# EAGLE design gps-carrier (EAGLE 5.11)
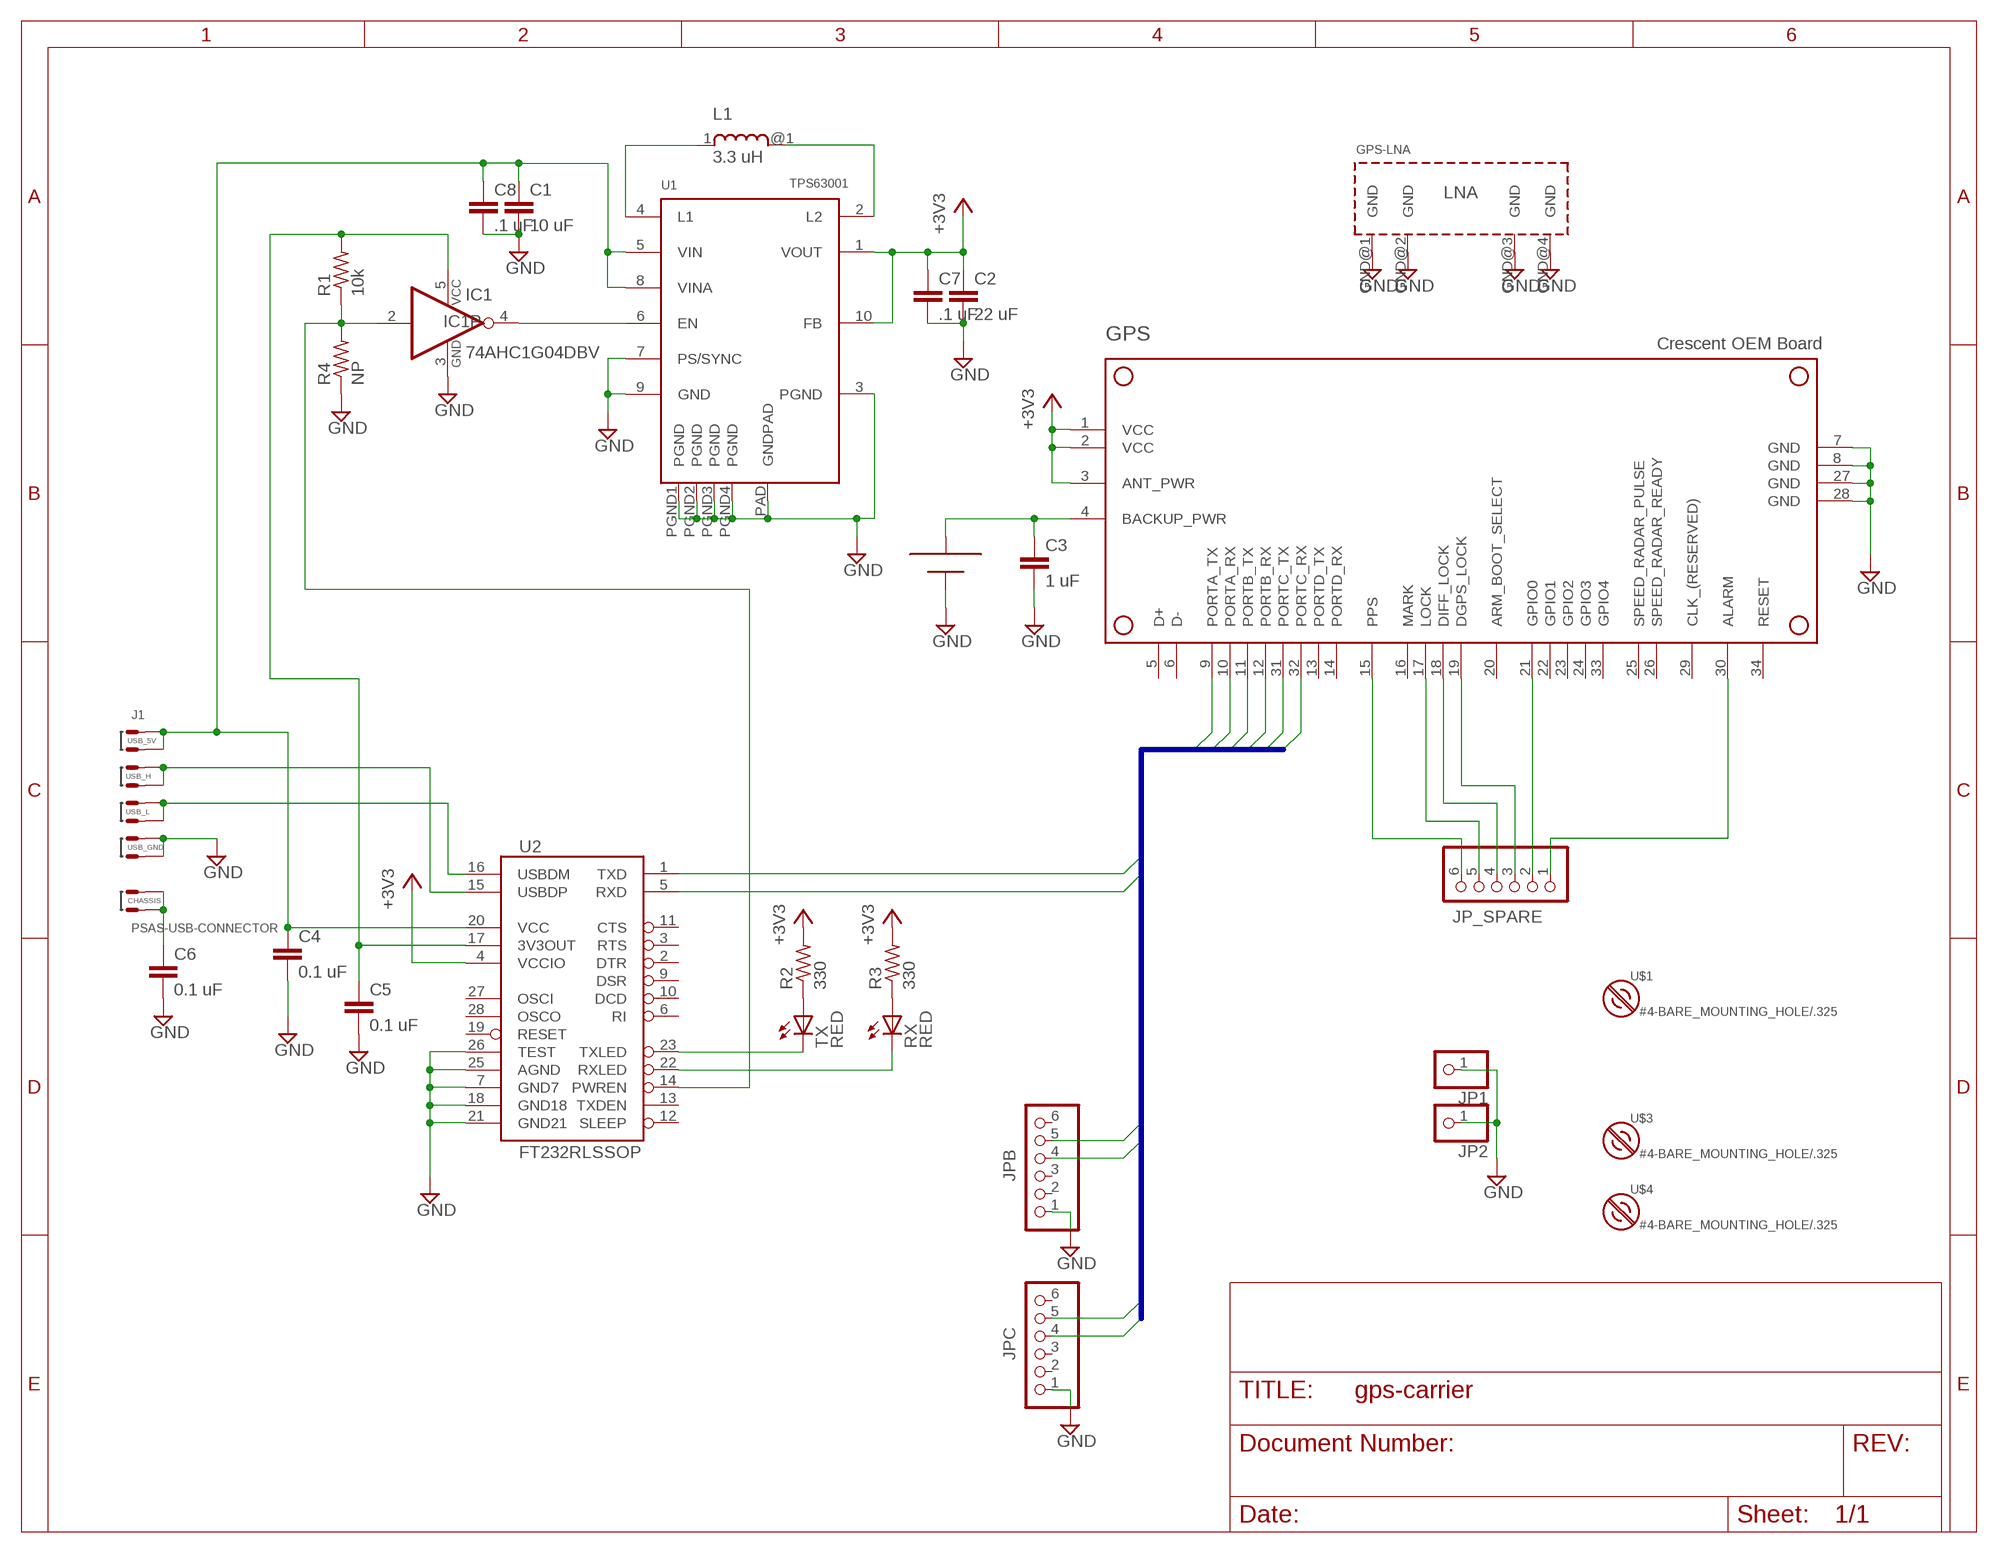
[diagram p0: schematic, sheet 1]

## Parts
BAT1  COINBAT  [COINBAT]
C1  10 uF  C-EU0805-B-NOSILK  [0805-B-NOSILK]
C2  22 uF  C-EU0805-B-NOSILK  [0805-B-NOSILK]
C3  1 uF  C-EU0603-B-NOSILK  [0603-B-NOSILK]
C4  0.1 uF  C-EU0603-B-NOSILK  [0603-B-NOSILK]
C5  0.1 uF  C-EU0603-B-NOSILK  [0603-B-NOSILK]
C6  0.1 uF  C-EU0603-B-NOSILK  [0603-B-NOSILK]
C7  .1 uF  C-EU0603-B-NOSILK  [0603-B-NOSILK]
C8  .1 uF  C-EU0603-B-NOSILK  [0603-B-NOSILK]
GPS  HEMISPHERE_GPS_MOUNT  [GPS_CRECENT_OUTLINE]
GPS-LNA  GPS_LNA  [GPS_LNA]
IC1  74AHC1G04DBV  [SOT23-5]
J1  PSAS-USB-CONNECTOR  [USB-CONNECTOR-PKG]
JP1  PINHD-1X1  [1X01]
JP2  PINHD-1X1  [1X01]
JP_SPARE  PINHD-1X6  [1X06]
JPB  PINHD-1X6  [1X06]
JPC  PINHD-1X6  [1X06]
L1  3.3 uH  CB2518  [SMD1007]
R1  10k  R-US_0603-B-NOSILK  [0603-B-NOSILK]
R2  330  R-US_0603-B-NOSILK  [0603-B-NOSILK]
R3  330  R-US_0603-B-NOSILK  [0603-B-NOSILK]
R4  NP  R-US_0603-B-NOSILK  [0603-B-NOSILK]
RX  RED  LEDCHIP-LED0603  [CHIP-LED0603]
TX  RED  LEDCHIP-LED0603  [CHIP-LED0603]
U1  TPS63001  [TPS63001]
U2  FT232RLSSOP  [SSOP28DB]
U$1  #4-BARE_MOUNTING_HOLE/.325  [#4/.325-BARE+SMALL_TOOL_CLEARANCE]
U$3  #4-BARE_MOUNTING_HOLE/.325  [#4/.325-BARE+SMALL_TOOL_CLEARANCE]
U$4  #4-BARE_MOUNTING_HOLE/.325  [#4/.325-BARE+SMALL_TOOL_CLEARANCE]

## Nets
3V3FTDI: C5.1 IC1.5(VCC) R1.2 U2.17(3V3OUT)
+3V3: C2.1 C7.1 GPS.1(VCC) GPS.2(VCC) GPS.3(ANT_PWR) R2.2 R3.2 U1.1(VOUT) U1.10(FB) U2.4(VCCIO)
ALARM: GPS.30(ALARM) JP_SPARE.1
D+: J1.USB_H@3(USB_H) J1.USB_H@4(USB_H) U2.15(USBDP)
D-: J1.USB_L@5(USB_L) J1.USB_L@6(USB_L) U2.16(USBDM)
DGPS_LOCK: GPS.19(DGPS_LOCK) JP_SPARE.3
DIFF_LOCK: GPS.18(DIFF_LOCK) JP_SPARE.4
EN: IC1.4(O) U1.6(EN)
GND: BAT1.- C1.2 C2.2 C3.2 C4.2 C5.2 C6.2 C7.2 C8.2 GPS-LNA.GND@1(GND) GPS-LNA.GND@2(GND) GPS-LNA.GND@3(GND) GPS-LNA.GND@4(GND) GPS.7(GND) GPS.8(GND) GPS.27(GND) GPS.28(GND) IC1.3(GND) J1.B-@7(GND) J1.B-@8(GND) JP1.1 JP2.1 JPB.1 JPC.1 R4.1 U1.3(PGND) U1.7(PS/SYNC) U1.9(GND) U1.PAD(GNDPAD) U1.PGND1(PGND) U1.PGND2(PGND) U1.PGND3(PGND) U1.PGND4(PGND) U2.7(GND7) U2.18(GND18) U2.21(GND21) U2.25(AGND) U2.26(TEST)
GPIO0: GPS.21(GPIO0) JP_SPARE.2
LEDRX: RX.C U2.22(RXLED)
LEDTX: TX.C U2.23(TXLED)
LOCK: GPS.17(LOCK) JP_SPARE.5
N$1: L1.1 U1.4(L1)
N$2: L1.@1 U1.2(L2)
N$3: BAT1.+ C3.1 GPS.4(BACKUP_PWR)
N$7: R2.1 TX.A
N$8: C6.1 J1.CHASSIS@1(CHASSIS) J1.CHASSIS@2(CHASSIS)
N$10: R3.1 RX.A
PORT_A_RX: GPS.10(PORTA_RX) U2.5(RXD)
PORT_A_TX: GPS.9(PORTA_TX) U2.1(TXD)
PORT_B_RX: GPS.12(PORTB_RX) JPB.5
PORT_B_TX: GPS.11(PORTB_TX) JPB.4
PORT_C_RX: GPS.32(PORTC_RX) JPC.5
PORT_C_TX: GPS.31(PORTC_TX) JPC.4
PPS: GPS.15(PPS) JP_SPARE.6
PWNEN: IC1.2(I) R1.1 R4.2 U2.14(PWREN)
VUSB: C1.1 C4.1 C8.1 J1.B+@1(5V) J1.B+@2(5V) U1.5(VIN) U1.8(VINA) U2.20(VCC)
Unconnected: GPS.5(D+) GPS.6(D-) GPS.13(PORTD_TX) GPS.14(PORTD_RX) GPS.16(MARK) GPS.20(ARM_BOOT_SELECT) GPS.22(GPIO1) GPS.23(GPIO2) GPS.24(GPIO3) GPS.25(SPEED_RADAR_PULSE) GPS.26(SPEED_RADAR_READY) GPS.29(CLK_(RESERVED)) GPS.33(GPIO4) GPS.34(RESET) JPB.2 JPB.3 JPB.6 JPC.2 JPC.3 JPC.6 U2.2(DTR) U2.3(RTS) U2.6(RI) U2.9(DSR) U2.10(DCD) U2.11(CTS) U2.12(SLEEP) U2.13(TXDEN) U2.19(RESET) U2.27(OSCI) U2.28(OSCO)

## Buses
PORT_A_TX,PORT_A_RX,PORT_B_TX,PORT_B_RX,PORT_C_TX,PORT_C_RX

## Library data of the parts
BAT1 = GPS_Hemisphere:COINBAT
C1-C8 = rcl_custom:C-EU: CAPACITOR, European symbol
GPS = GPS_Hemisphere:HEMISPHERE_GPS_MOUNT: Outline for the "Hemisphere GPS" Crescent OEM Board
GPS-LNA = GPS_Hemisphere:GPS_LNA
IC1 = 74xx-little-us:74*1G04: INVERTER Gate
J1 = usb-connector:PSAS-USB-CONNECTOR
JP1 JP2 = pinhead:PINHD-1X1: PIN HEADER
JP_SPARE JPB JPC = pinhead:PINHD-1X6: PIN HEADER
L1 = GPS_Hemisphere:CB2518: 3.3 uH Inductor
R1-R4 = rcl_custom:R-US_: RESISTOR, American symbol
RX TX = led:LED: LED OSRAM: - CHIPLED LG R971, LG N971, LY N971, LG Q971, LY Q971, LO R971, LY R971 LH N974, LH R974 LS Q976, LO Q976, LY Q976 LO Q996 - Hyper CHIPLED LW Q18S LB Q993, LB Q99A, LB R99A - SideLED LS A670, LO A670, LY A670, LG A670, LP A670 LB A673, LV A673, LT A673, LW A673 LH A674 LY A675 LS A676, LA A676, LO A676, LY A676, LW A676 LS A679, LY A679, LG A679 - Hyper Micro SIDELED® LS Y876, LA Y876, LO Y876, LY Y876 LT Y87S - SmartLED LW L88C, LW L88S LB L89C, LB L89S, LG L890 LS L89K, LO L89K, LY L89K LS L896, LA L896, LO L896, LY L896 - TOPLED LS T670, LO T670, LY T670, LG T670, LP T670 LSG T670, LSP T670, LSY T670, LOP T670, LYG T670 LG T671, LOG T671, LSG T671 LB T673, LV T673, LT T673, LW T673 LH T674 LS T676, LA T676, LO T676, LY T676, LB T676, LH T676, LSB T676, LW T676 LB T67C, LV T67C, LT T67C, LS T67K, LO T67K, LY T67K, LW E67C LS E67B, LA E67B, LO E67B, LY E67B, LB E67C, LV E67C, LT E67C LW T67C LS T679, LY T679, LG T679 LS T770, LO T770, LY T770, LG T770, LP T770 LB T773, LV T773, LT T773, LW T773 LH T774 LS E675, LA E675, LY E675, LS T675 LS T776, LA T776, LO T776, LY T776, LB T776 LHGB T686 LT T68C, LB T68C - Hyper Mini TOPLED® LB M676 - Mini TOPLED Santana® LG M470 LS M47K, LO M47K, LY M47K Source: http://www.osram.convergy.de LUXEON: - LUMILED® LXK2-PW12-R00, LXK2-PW12-S00, LXK2-PW14-U00, LXK2-PW14-V00 LXK2-PM12-R00, LXK2-PM12-S00, LXK2-PM14-U00 LXK2-PE12-Q00, LXK2-PE12-R00, LXK2-PE12-S00, LXK2-PE14-T00, LXK2-PE14-U00 LXK2-PB12-K00, LXK2-PB12-L00, LXK2-PB12-M00, LXK2-PB14-N00, LXK2-PB14-P00, LXK2-PB14-Q00 LXK2-PR12-L00, LXK2-PR12-M00, LXK2-PR14-Q00, LXK2-PR14-R00 LXK2-PD12-Q00, LXK2-PD12-R00, LXK2-PD12-S00 LXK2-PH12-R00, LXK2-PH12-S00 LXK2-PL12-P00, LXK2-PL12-Q00, LXK2-PL12-R00 Source: www.luxeon.com KINGBRIGHT: KA-3528ASYC Source: www.kingbright.com
U1 = GPS_Hemisphere:TPS63001: High efficiency buck boost SPS
U2 = GPS_Hemisphere:FT232RL: USB UART FT232RL 4th Generation USB UART (USB <-> Serial) Controller. Spark Fun Electronics SKU : COM-00650
U$1 U$3 U$4 = mount:#4-BARE_MOUNTING_HOLE: 1/8" drill hole for #4 screw mount

## Board
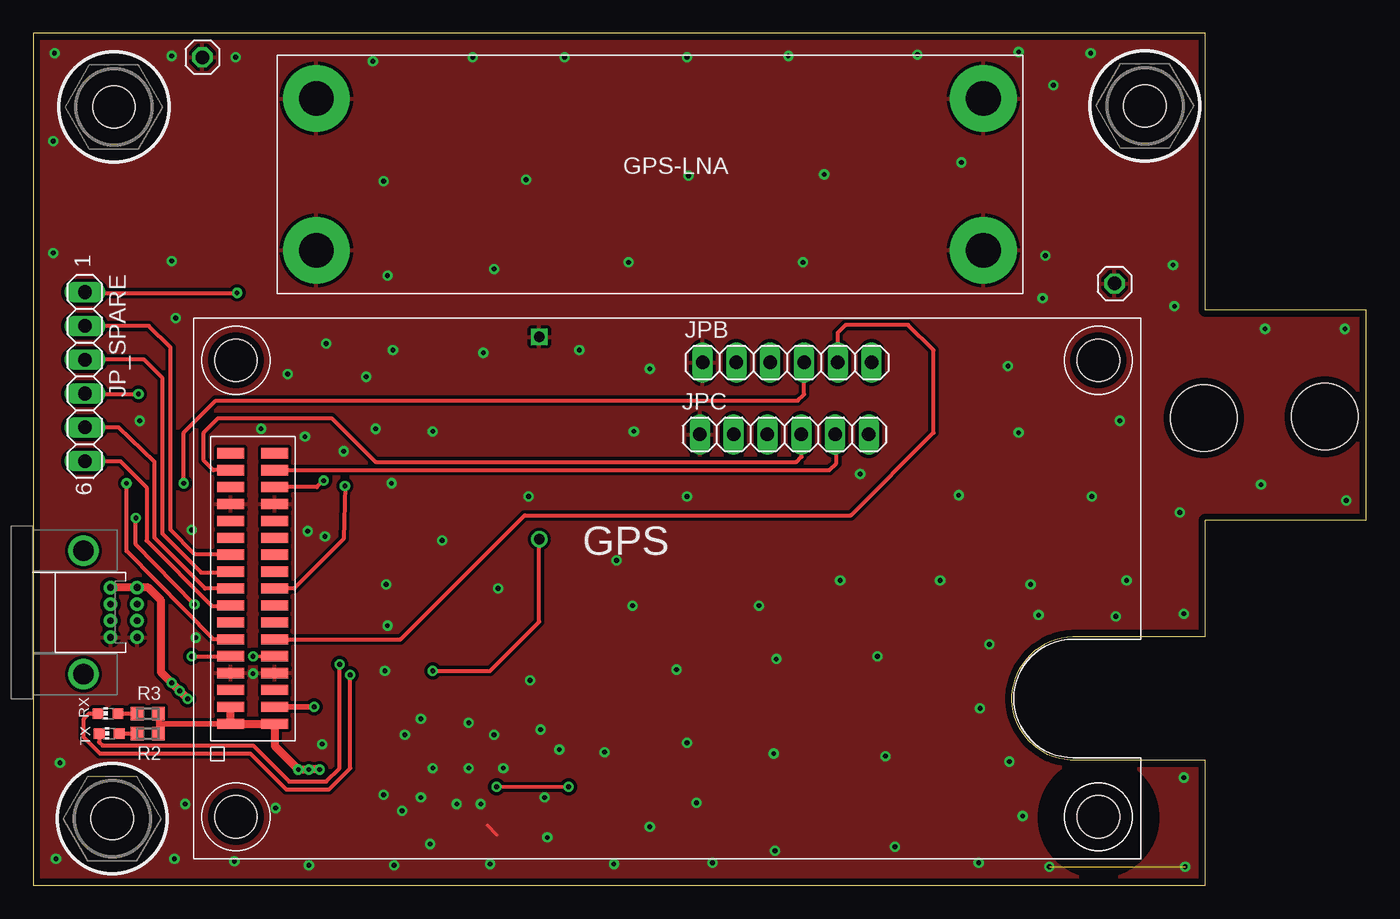
[diagram p1: board, top side]
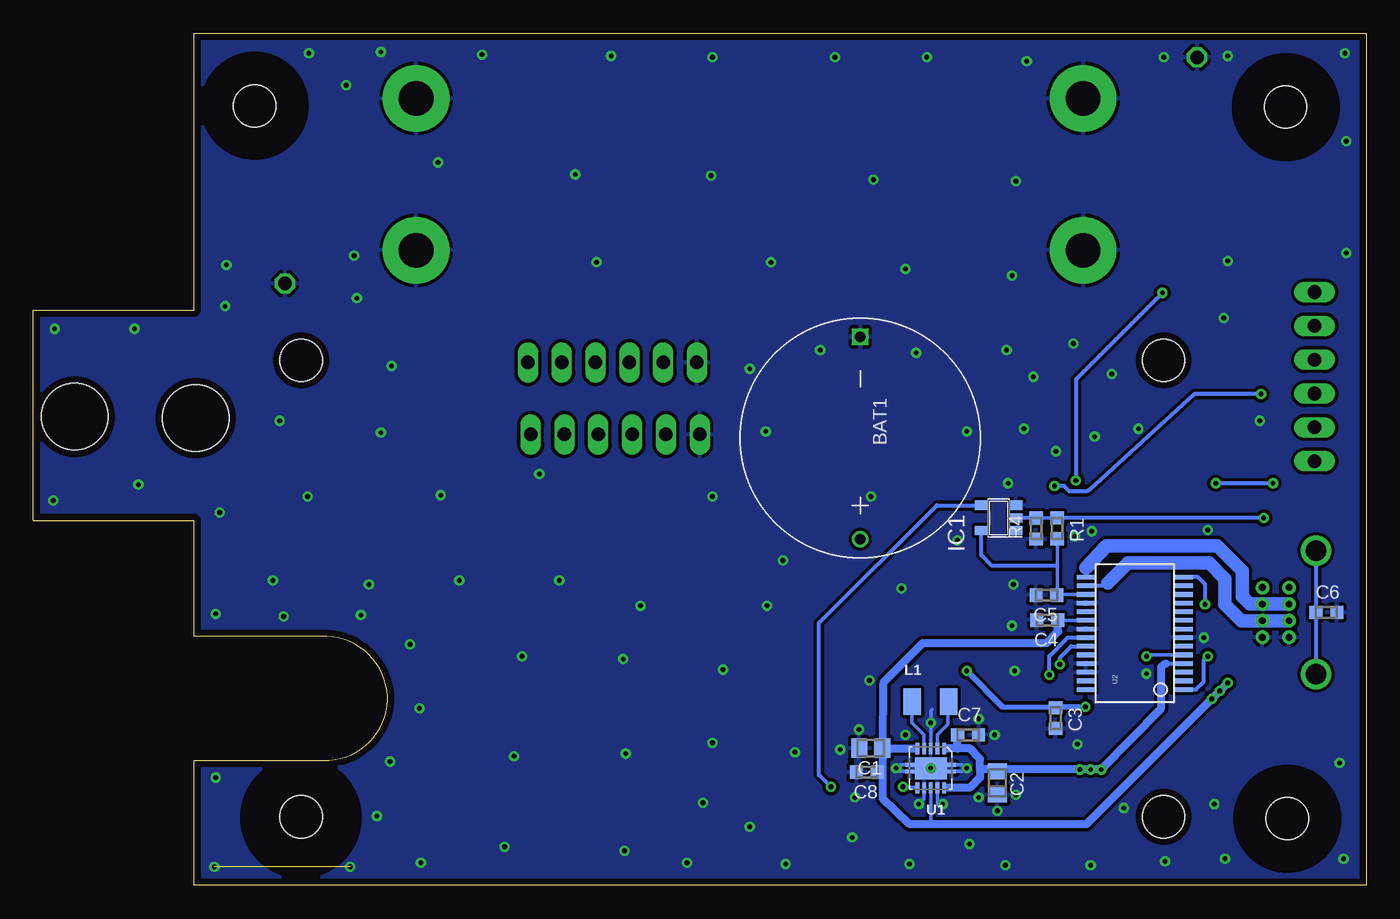
[diagram p2: board, bottom side, seen from below]

Size 100.1 x 64 mm. Coordinates in mm from the lower left corner, seen from the top.
Outline: 0,0 88,0 88,9.4 78.3,9.4 arc-90 73.5,13.9 73.5,14.2 arc-90 78.5,18.7 88,18.7 88,27.4 100.1,27.4 100.1,43.2 88,43.2 88,64 0,64 0,0
Copper layers (1*16): Top 0.0178mm / dielectric 1.4986mm / Bottom 0.0178mm
Design rules "sunstone_eagle_2lyr_rules_v1.0.0.3": minimum track width 6mil, minimum drill 14mil, track to track 6mil, track to pad 6mil, pad to pad 6mil, via to via 6mil, smd to smd 6mil, copper to edge 20mil, drill to drill 16mil, minimum pad ring 8mil, minimum via ring 8mil, stop-mask expansion 3mil, vias tented up to drill 0mil, thermal gap 10mil
Holes 5 mm at 87.9,35.1 97,35.2
tRestrict: area 75.9,1 to 84.1,9.2
bRestrict: area 75.9,1 to 84.1,9.2

### Footprints (pad centres in the part's own frame; a part is rotated, then mirrored left to right if it is on the bottom)
COINBAT = drill 0.8 round: + 7.6,0 | drill 0.8 square: - -7.6,0
0805-B-NOSILK = smd 1.15 x 1.45: 1 -0.9,0; 2 0.9,0
0603-B-NOSILK = smd 0.95 x 1: 1 -0.8,0; 2 0.8,0
GPS_CRECENT_OUTLINE = smd 2.032 x 0.762: 1 -32.766,-10.16; 2 -29.464,-10.16; 3 -32.766,-8.89; 4 -29.464,-8.89; 5 -32.766,-7.62; 6 -29.464,-7.62; 7 -32.766,-6.35; 8 -29.464,-6.35; 9 -32.766,-5.08; 10 -29.464,-5.08; 11 -32.766,-3.81; 12 -29.464,-3.81; 13 -32.766,-2.54; 14 -29.464,-2.54; 15 -32.766,-1.27; 16 -29.464,-1.27; 17 -32.766,0; 18 -29.464,0; 19 -32.766,1.27; 20 -29.464,1.27; 21 -32.766,2.54; 22 -29.464,2.54; 23 -32.766,3.81; 24 -29.464,3.81; 25 -32.766,5.08; 26 -29.464,5.08; 27 -32.766,6.35; 28 -29.464,6.35; 29 -32.766,7.62; 30 -29.464,7.62; 31 -32.766,8.89; 32 -29.464,8.89; 33 -32.766,10.16; 34 -29.464,10.16 | hole 3.175: -32.385,17.145; -32.385,-17.145; 32.385,-17.145; 32.385,17.145
GPS_LNA = drill 2.6 pad 5 round: GND@1 -25.05,5.7; GND@2 -25.05,-5.7; GND@3 25.05,5.7; GND@4 25.05,-5.7
SOT23-5 = smd 0.69 x 0.99: 1 -0.95,-1.29; 2 0,-1.29; 3 0.95,-1.29; 4 0.95,1.3; 5 -0.95,1.3
USB-CONNECTOR-PKG = drill 0.508 pad 1.016 round: B+@1 2,1.875; B+@2 0,1.875; B-@7 2,-1.875; B-@8 0,-1.875; USB_H@3 2,0.625; USB_H@4 0,0.625; USB_L@5 2,-0.625; USB_L@6 0,-0.625 | drill 1.511 round: CHASSIS@1 -2.032,4.636; CHASSIS@2 -2.032,-4.636
1X01 = drill 1.016 octagon: 1 0,0
1X06 = drill 1.016 long: 1 -6.35,0; 2 -3.81,0; 3 -1.27,0; 4 1.27,0; 5 3.81,0; 6 6.35,0
SMD1007 = smd 1.3 x 2: 1 -1.4,0; @1 1.35,0
CHIP-LED0603 = smd 0.8 x 0.8: A 0,-0.75; C 0,0.75
TPS63001 = smd 0.28 x 0.85: 1 -1,-1.475; 2 -0.5,-1.475; 3 0,-1.475; 4 0.5,-1.475; 5 1,-1.475; 6 1,1.475; 7 0.5,1.475; 8 0,1.475; 9 -0.5,1.475; 10 -1,1.475 | smd 2.4 x 1.65: PAD 0,0 | smd 0.7 x 0.28: PGND1 1.55,0.25; PGND2 -1.55,0.25; PGND3 -1.55,-0.25; PGND4 1.55,-0.25
SSOP28DB = smd 0.348 x 1.397: 1 -4.225,-3.656; 2 -3.575,-3.656; 3 -2.925,-3.656; 4 -2.275,-3.656; 5 -1.625,-3.656; 6 -0.975,-3.656; 7 -0.325,-3.656; 8 0.325,-3.656; 9 0.975,-3.656; 10 1.625,-3.656; 11 2.275,-3.656; 12 2.925,-3.656; 13 3.575,-3.656; 14 4.225,-3.656; 15 4.225,3.656; 16 3.575,3.656; 17 2.925,3.656; 18 2.275,3.656; 19 1.625,3.656; 20 0.975,3.656; 21 0.325,3.656; 22 -0.325,3.656; 23 -0.975,3.656; 24 -1.625,3.656; 25 -2.275,3.656; 26 -2.925,3.656; 27 -3.575,3.656; 28 -4.225,3.656
#4/.325-BARE+SMALL_TOOL_CLEARANCE = hole 3.175: 0,0

### Placement (x,y rotation side)
BAT1  38,33.6 270 bottom
C1  37.2,10.3 180 bottom
C2  27.7,7.7 270 bottom
C3  23.33,12.56 270 bottom
C4  23.94,19.93 180 bottom
C5  24,21.8 180 bottom
C6  3,20.5 0 bottom
C7  29.9,11.3 0 bottom
C8  37.5,8.5 180 bottom
GPS  47.6,22.29 0 top
GPS-LNA  46.3,53.4 0 top
IC1  27.6,27.6 90 bottom
J1  5.8,20.5 0 top
JP1  12.7,62.2 0 top
JP2  81.2,45.2 0 top
JP_SPARE  3.87,38.21 270 top
JPB  56.61,39.27 0 top
JPC  56.4,33.87 0 top
L1  32.7,13.8 0 bottom
R1  23.2,26.8 270 bottom
R2  8.6,11.4 0 top
R3  8.6,12.9 0 top
R4  24.8,26.8 90 bottom
RX  5.6,12.9 90 top
TX  5.7,11.4 90 top
U1  32.7,8.8 180 bottom
U2  17.39,18.93 90 bottom
U$1  5.93,5.01 0 top
U$3  6.05,58.46 0 top
U$4  83.48,58.55 0 top

### Tracks (layer width: path | path; a pad name or v marks a point on that pad's centre or on a via)
3V3FTDI
  Bottom 0.25: 23.2,21.98 23.2,24 R1.2
  Bottom 0.254: U2.17 23.11,21.86 C5.1
  Bottom 0.3: IC1.5 28.9,24.8 28.1,24 23.2,24
  Bottom 0.305: IC1.5 29,26.63
  Bottom 0.406: IC1.5 29,26.73 | C5.1 23.08,21.86
  Bottom 0.61: 23.08,21.86 23.2,21.98
+3V3  (via drill 0.36)
  Top 0.406: R2.2 R3.2 9.4,12.13 GPS.1
  Top 0.6: GPS.3 GPS.1 GPS.2 18.14,10.46 v19.9,8.7 v20.7,8.7 v21.5,8.7
  Bottom 0.25: 29,8.7 27.69,8.7 C2.1 | 31.52,10.28 U1.1 | 31.52,7.33 U1.10
  Bottom 0.305: 15.04,16.66 U2.4
  Bottom 0.6: 29,8.7 29,8.1 29.77,7.33 31.52,7.33 | 29,8.7 29,9.5 29.77,10.28 30.7,10.28 | 29,8.7 v21.5,8.7 v19.9,8.7 15.4,13.3 15.4,16.4 15.04,16.66 | 30.7,10.28 31.52,10.28 | 30.7,10.28 C7.1
ALARM  (via drill 0.36)
  Top 0.305: GPS.30 21.29,29.91 v21.8,30.4 | v15.3,44.5 3.93,44.5 JP_SPARE.1
  Bottom 0.305: v21.8,30.4 21.8,38 v15.3,44.5
D+
  Bottom 0.305: 21.05,23.86 U2.15
  Bottom 1: 21.05,23.86 19.5,25.5 11.2,25.5 9.3,23.6 9.3,21.7 8.72,21.12 J1.USB_H@3 J1.USB_H@4
D-
  Bottom 0.305: 19.4,22.7 19.4,22.5 U2.16
  Bottom 1: 19.4,22.7 17.9,24.2 11.8,24.2 10.6,23 10.6,21.1 9.38,19.88 J1.USB_L@5 J1.USB_L@6
DGPS_LOCK
  Top 0.305: JP_SPARE.3 8.32,39.48 9.7,38.1 9.7,26.4 12.6,23.5 14.77,23.5 GPS.19
DIFF_LOCK  (via drill 0.36)
  Top 0.305: GPS.18 19.59,22.29 23.3,26 v23.4,30 | v7.9,36.9 3.91,36.9 JP_SPARE.4
  Bottom 0.305: v7.9,36.9 12.9,36.9 20.8,29.7 21,29.6 22.3,29.6 22.7,30 v23.4,30
EN  (via drill 0.36)
  Top 0.25: v34.8,7.4 v40.2,7.4
  Bottom 0.25: U1.6 33.84,7.34 34.74,7.34 v34.8,7.4
  Bottom 0.3: IC1.4 32.25,28.55 41.1,19.7 41.1,8.3 v40.2,7.4
  Bottom 0.305: 29.03,28.6 IC1.4 28.97,28.6
GND  (via drill 0.36)  (1 unrouted)
  Top 0.25: 34.1,4.5 34.8,3.8
  Bottom 0.25: 31.67,6.03 32.17,6.03 32.2,6.06 U1.9 | 30.33,8.57 v30,8.8 30.35,8.55 U1.PGND2 | U1.3 32.7,13.1 32.67,13.13 | U1.7 33.2,6.5 33.4,6.3 | 30.35,9.05 U1.PGND3 | U1.PGND4 35.05,9.05 | U1.PGND1 35.05,8.55
  Bottom 0.254: v30,8.8 30,8.56 | 37.7,10.14 C1.2 | 32.67,13.13 32.6,13.2
  other vias: 32.7,8.8 39.5,10.2 27.7,5.6 29.8,3.1 42.9,10 49.1,10.7 49.8,6.2 46.3,4.4 32.7,12.2 37.3,15.4 27.9,11.3 34.9,22.3 30.7,25.9 26.5,22.6 26.6,19.5 26.9,30.2 37.2,29.2 49.1,29.2 43.8,24.4 45,21 54.5,21 55.7,2.6 55.6,9.9 55.8,17 60.6,22.9 68.1,22.9 74.9,22.6 82.1,22.9 63.4,17.2 64,9.7 64.7,2.9 71,1.7 73.3,9.3 71.8,18.1 75.5,20.3 81.3,20.2 71.1,13.3 74.3,5.2 48.3,16.2 62.1,30.9 69.5,29.3 79.5,29.2 73.2,39 74,34 81.6,34.9 46.3,38.8 33.8,40 27,40.2 45.1,34.1 30,34.1 23.3,32.6 20.4,33.7 17.1,34.3 22,40.7 10.7,42.6 1.5,47.5 26.6,45.8 25.5,61.9 33,62.2 39.9,62.2 49.1,62.2 56.7,62.3 66.4,62.4 74,62.6 79.4,62.5 76.6,60.1 76,47.3 75.8,44.1 85.6,46.6 85.7,43.5 51,1.7 43.6,1.6 34.3,1.6 38.6,3.6 38.4,6.6 27.1,1.5 20.7,1.5 15.1,1.8 10.6,2 11.4,6.1 2,9.2 1.7,2 20.6,26.6 12.2,18.6 10.4,46.9 21.9,26.2 11.9,26.7 8,34.9 19.1,38.4 25,38.2 25.7,34.3 41,40.2 26.3,52.9 37,53 49.2,53.3 59.4,53.4 69.7,54.3 57.8,46.8 44.7,46.8 34.6,46.3 15.2,62.2 10.4,62.3 1.6,62.5 1.5,55.9 92.2,30.1 92.5,41.8 98.5,41.8 98.6,28.9 86.1,28 86.4,20.4 86.4,8.1 86.5,1.4 76.3,1.4 18.2,5.8 21.7,10.6 33.6,6.1 31.8,6.1 16.5,15.9 35.3,8.8 26.4,16.1 29.1,12.5 26.3,6.8 34.6,11.3 38.1,11.7 29.1,6.6
  pour Top (isolate 0.25): 0,0 0,64 88,64 88,43.2 100.1,43.2 100.1,27.4 88,27.4 88,0
  pour Bottom (isolate 0.25): 0,0 0,64 88,64 88,43.2 100.1,43.2 100.1,27.4 88,27.4 88,0
GPIO0
  Top 0.305: JP_SPARE.2 8.68,42.02 10.3,40.4 10.3,26.7 12.1,24.9 14.76,24.9 GPS.21
LEDRX  (via drill 0.36)
  Top 0.305: RX.C 4.2,12.9 3.8,12.5 3.8,11.1 5,9.9 16.3,9.9 19,7.2 22.2,7.2 23.8,8.8 v23.8,15.8
  Bottom 0.305: U2.22 22.39,18.61 23.8,17.2 v23.8,15.8
LEDTX  (via drill 0.36)
  Top 0.305: TX.C 4.95,10.75 5.2,10.5 16.5,10.5 19.2,7.8 22,7.8 23,8.8 v23,16.6
  Bottom 0.305: v23,16.6 23,17.1 22.14,17.95 U2.23
LOCK
  Top 0.305: JP_SPARE.5 6.4,34.4 9.1,31.8 9.1,26.1 12.9,22.3 GPS.17
N$1
  Bottom 0.25: U1.4 33.2,11.3 34.1,12.2 L1.1
N$2
  Bottom 0.25: U1.2 32.2,11.3 31.4,12.1 31.4,13.75 L1.@1
N$3  (via drill 0.36)
  Top 0.305: v30,16.1 34.3,16.1 38,19.8 BAT1.+
  Top 0.406: GPS.4 v21.1,13.4
  Bottom 0.406: v21.1,13.4 23.32,13.4 C3.1 27.31,13.41 v30,16.1
N$7
  Top 0.305: TX.A R2.1
N$8
  Bottom 0.305: J1.CHASSIS@2 3.77,20.42 C6.1 3.77,20.58 J1.CHASSIS@1
N$10
  Top 0.305: RX.A R3.1
PORT_A_RX  (via drill 0.36)
  Top 0.254: v16.5,17.2 18.25,17.2 GPS.10
  Bottom 0.254: U2.5 16.3,17.3 v16.5,17.2
PORT_A_TX  (via drill 0.36)
  Top 0.305: v11.9,17.2 GPS.9
  Bottom 0.305: U2.1 12.79,14.71 12.2,15.3 12.2,16.9 v11.9,17.2
PORT_B_RX
  Top 0.305: JPB.5 60.4,39.29 60.4,41.5 61,42.1 65.7,42.1 67.6,40.2 67.6,34 61.4,27.8 36.9,27.8 27.58,18.48 GPS.12
PORT_B_TX  (via drill 0.36)
  Top 0.305: JPB.4 57.88,36.88 57.4,36.4 13.7,36.4 11.3,34 v11.3,30.2 | v7,30.2 7,25.1 13.5,18.5 14.81,18.5 GPS.11
  Bottom 0.305: v7,30.2 v11.3,30.2
PORT_C_RX
  Top 0.305: GPS.32 59.78,31.18 60.3,31.7 60.3,33.78 JPC.5
PORT_C_TX
  Top 0.305: JPC.4 57.7,33.84 57.7,32.2 57.3,31.8 25.7,31.8 22.4,35.1 13.9,35.1 12.8,34 12.8,31.9 13.52,31.18 GPS.31
PPS
  Top 0.305: JP_SPARE.6 6.54,31.86 8.5,29.9 8.5,25.9 13.4,21 14.81,21 GPS.15
PWNEN  (via drill 0.36)
  Top 0.305: v12.1,21.1 7.7,25.6 v7.7,27.6
  Bottom 0.25: R1.1 23.3,27.5 23.4,27.6 25.1,27.6
  Bottom 0.254: 13.8,23.16 U2.14
  Bottom 0.3: 25.1,27.6 IC1.2
  Bottom 0.305: v7.7,27.6 R1.1 | 25.1,27.6 R4.2 | 13.8,23.16 12.65,23.16 12.1,22.6 v12.1,21.1
VUSB  (via drill 0.36)
  Top 0.6: J1.B+@2 J1.B+@1 8.62,22.38 9.6,21.4 9.6,16 v10.4,15.2 v11,14.6 v11.6,14
  Bottom 0.25: 33.88,10.28 U1.5 | U1.8 32.7,4.86 32.67,4.83 32.67,4.73
  Bottom 0.254: U2.20 23.03,19.91 C4.1
  Bottom 0.3: C8.1 36.5,8.5 36.3,8.7
  Bottom 0.305: 32.8,4.6 32.67,4.73
  Bottom 0.6: v10.4,15.2 21,4.6 32.8,4.6 34.3,4.6 36.3,6.5 36.3,8.7 C1.1 | 33.88,10.28 35.92,10.28 C1.1 | C1.1 36.25,15.25 35.9,15.6
  Bottom 0.61: 35.9,15.6 33.3,18.2 24,18.2 23.14,19.06 C4.1

### Text on the board
tPlace: 1 | 6